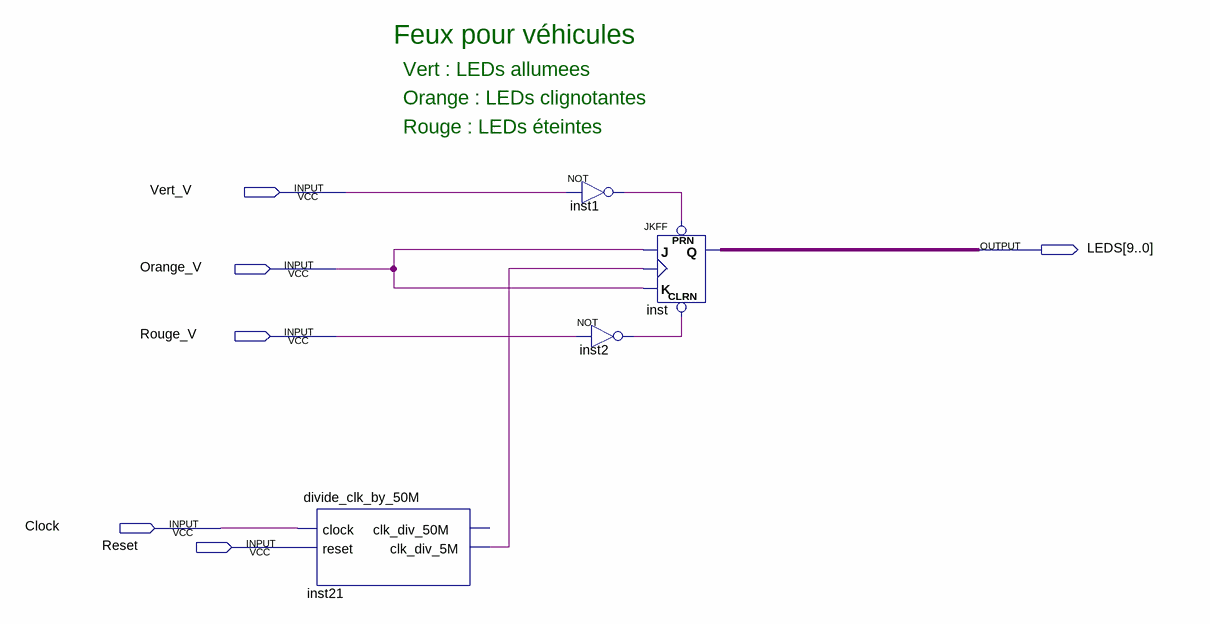
[diagram p0: schematic sheet]
// Quartus schematic Affichage_vehicules.bdf as structural Verilog: 4 symbols, 6 pins
module Affichage_vehicules (
  input  Vert_V,
  input  Orange_V,
  input  Rouge_V,
  input  Clock,
  input  Reset,
  output [9:0] LEDS
);

  wire inst1_out, inst2_out, inst21_clk_div_5m;

  divide_clk_by_50M inst21 (.clock(Clock), .reset(Reset), .clk_div_5M(inst21_clk_div_5m));  // open: clk_div_50M
  not inst1 (inst1_out, Vert_V);
  not inst2 (inst2_out, Rouge_V);
  JKFF inst[9:0] (.PRN(inst1_out), .CLRN(inst2_out), .K(Orange_V), .J(Orange_V), .CLK(inst21_clk_div_5m), .Q(LEDS));

  // Notes on the sheet:
  //   Feux pour véhicules    
  //   Vert : LEDs allumees
  //   Orange : LEDs clignotantes
  //   Rouge : LEDs éteintes
endmodule
